# Altium project 2560_TrainingKit.PrjPcb (part 2 of 4)

## Sheet [04] - TK2560_Power.SchDoc: 2560_TrainingKit
size A4; SheetNumber: 5; SheetTotal: 15
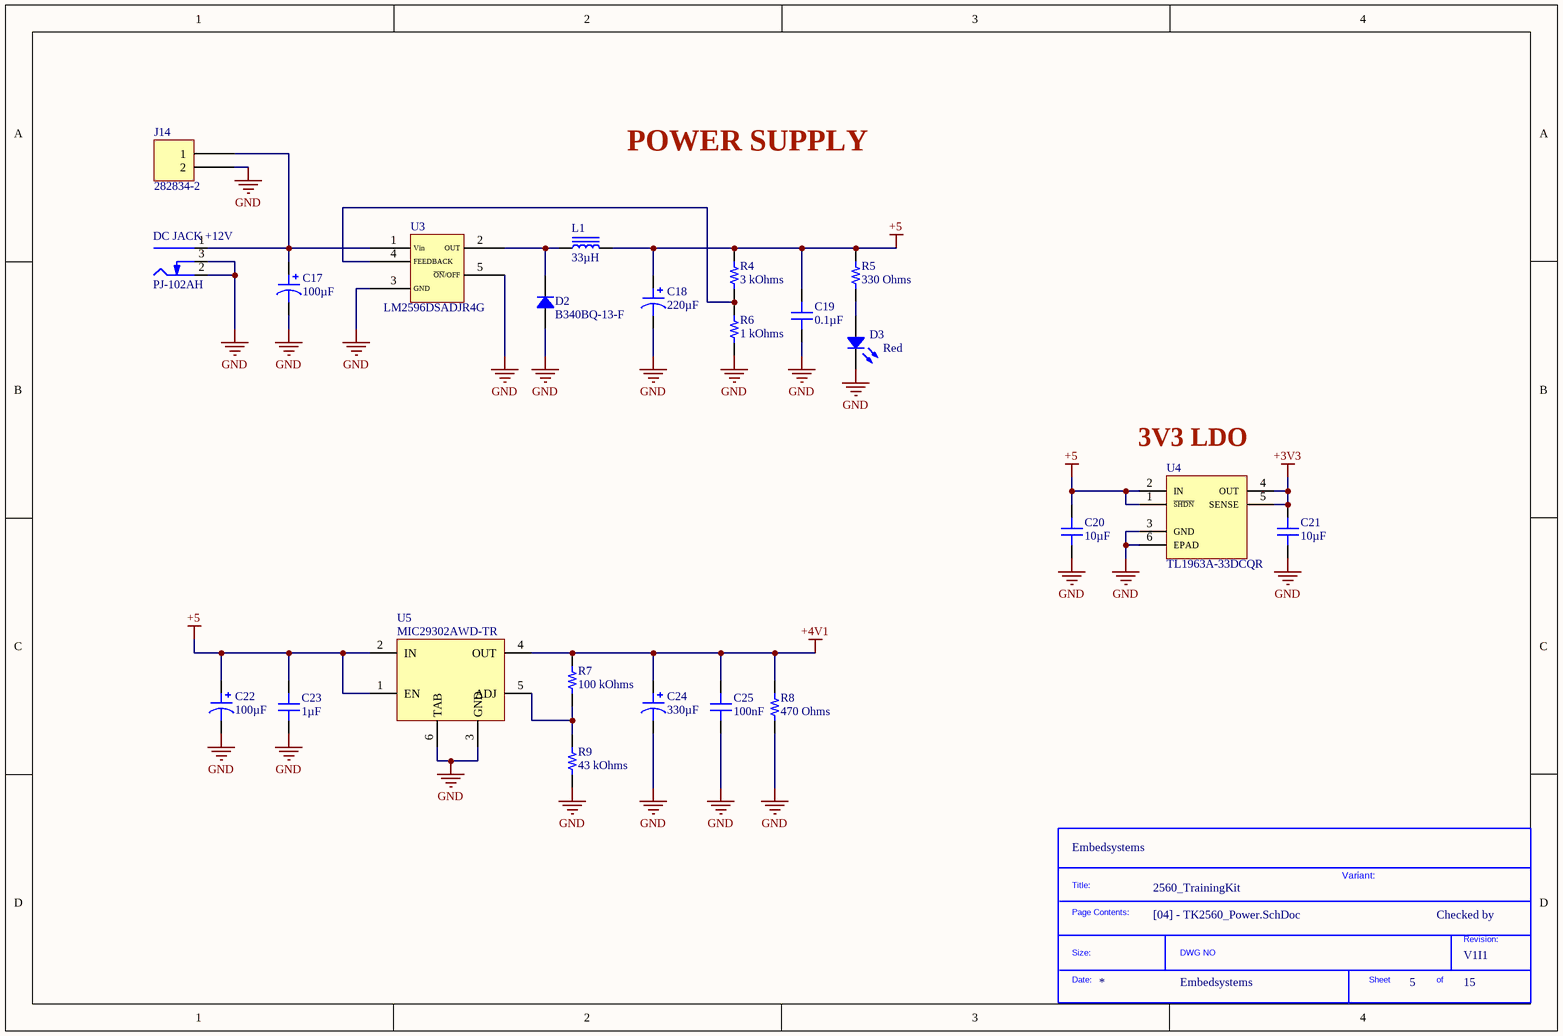
[diagram p3: [04] - TK2560_Power.SchDoc]

### Parts
(Parts that share a designator on the sheet are numbered #1, #2 ... from top to bottom, then left to right.)
*?#3  SDTitleBlock  (value not drawn)  (graphical)
C17  100µF  [CAP ALSMD 8.3MM H10.5MM]
C18  220µF  [CAP ALSMD 8.3MM H10.5MM]
C19  0.1µF  [CAP 0805_2012]
C20  10µF  [CAP 0805_2012]
C21  10µF  [CAP 0805_2012]
C22  100µF  [CAP POL 1411_3528]
C23  1µF  [CAP 0805_2012]
C24  330µF  [CAP POL 1411_3528]
C25  100nF  [CAP 0805_2012]
D2  B340BQ-13-F  [DO214AA SMB]
D3  Red  [LED 1206_3216 RED]
DC_JACK_+12V  PJ-102AH  [CUI PJ-102AH]
J14  282834-2  [TE 282834-2]
L1  33µH  [BOURNS SRR1280]
R4  3 kOhms  [RES 0805_2012]
R5  330 Ohms  [RES 0805_2012]
R6  1 kOhms  [RES 0805_2012]
R7  100 kOhms  [RES 0805_2012]
R8  470 Ohms  [RES 0805_2012]
R9  43 kOhms  [RES 0805_2012]
U3  LM2596DSADJR4G  [D2PAK 5_LEAD]
U4  TL1963A-33DCQR  [DCQ(R-PDSO-G6)]
U5  MIC29302AWD-TR  [TO-252-5]

### Nets
+3V3: C21.2 U4.4(OUT) U4.5(SENSE)
+4V1: C24.1 C25.2 R7.2 R8.2 U5.4(OUT)
+5: C18.1 C19.2 C20.2 C22.1 C23.2 L1.2 R4.2 R5.2 U4.1(~{SHDN}) U4.2(IN) U5.1(EN) U5.2(IN)
GND: C17.2 C18.2 C19.1 C20.1 C21.1 C22.2 C23.1 C24.2 C25.1 D2.1 D3.2 DC_JACK_+12V.2(Outer) DC_JACK_+12V.3(SW) J14.2 R6.1 R8.1 R9.1 U3.3(GND) U3.5(~{ON}/OFF) U4.3(GND) U4.6(EPAD) U5.3(GND) U5.6(TAB)
NetC17_1: C17.1 DC_JACK_+12V.1(Centre) J14.1 U3.1(Vin)
NetD2_2: D2.2 L1.1 U3.2(OUT)
NetD3_1: D3.1 R5.1
NetR4_1: R4.1 R6.2 U3.4(FEEDBACK)
NetR7_1: R7.1 R9.2 U5.5(ADJ)

### Notes on the sheet
- POWER SUPPLY
- (near U4) 3V3 LDO
- Variant:
- Checked by
- (in symbol SDTitleBlock) Title:; Page Contents:; Revision:; Size:; DWG NO; Date:; Sheet; of

### Library data of the parts
C17 = UWZ1H101MCL1GS: CAP ALUM 100UF 20% 50V SMD; Manufacturer: Nichicon; Lifetime @ Temp.: 1000 Hrs @ 105°C; Polarization: Polar; Ripple Current @ High Frequency: 210mA @ 10kHz; Ripple Current @ Low Frequency: 140mA @ 120Hz; Surface Mount Land Size: 0.327" L x 0.327" W (8.30mm x 8.30mm); Part Number: UWZ1H101MCL1GS; Applications: High Temperature Reflow; Capacitance: 100µF; ComponentLink1Description: Datasheet; ComponentLink1URL: http://nichicon-us.com/english/products/pdfs/e-uwz.pdf; ComponentLink2Description: DigiKey Link; ComponentLink2URL: http://digikey.com/product-detail/en/nichicon/UWZ1H101MCL1GS/493-6336-1-ND/3438850; Device Package: Radial, Can - SMD; Height - Seated (Max): 0.413" (10.50mm); LastUpdated: 02/09/2020 01:25:15; Lifecycle Status: Active; Minimum Order: 1; Mounting Type: Surface Mount; Operating Temperature: -55°C ~ 105°C; Package / Case: Radial, Can - SMD; Packaging: TapeAndReel; PartId: 7569; Part Status: Active; Price: 0.20; Series: UWZ; Size / Dimension: 0.315" Dia (8.00mm); Supplier 1: DigiKey; Supplier Part Number 1: 493-6336-1-ND; Tolerance: ±20%; Value: 100µF; Voltage - Rated: 50V
C18 = UUR1E221MNL6GS: CAP ALUM 220UF 20% 25V SMD; Manufacturer: Nichicon; Lifetime @ Temp.: 2000 Hrs @ 85°C; Ripple Current @ High Frequency: 301.6mA @ 10kHz; Ripple Current @ Low Frequency: 232mA @ 120Hz; Surface Mount Land Size: 0.327" L x 0.327" W (8.30mm x 8.30mm); Part Number: UUR1E221MNL6GS; Applications: General Purpose; Capacitance: 220µF; ComponentLink1Description: Datasheet; ComponentLink1URL: http://nichicon-us.com/english/products/pdfs/e-uur.pdf; ComponentLink2Description: DigiKey Link; ComponentLink2URL: http://digikey.com/product-detail/en/nichicon/UUR1E221MNL6GS/493-6222-1-ND/3438735; Device Package: Radial, Can - SMD; Height - Seated (Max): 0.413" (10.50mm); LastUpdated: 02/09/2020 01:25:16; Lifecycle Status: Active; Minimum Order: 1; Mounting Type: Surface Mount; Operating Temperature: -40°C ~ 85°C; Package / Case: Radial, Can - SMD; Packaging: TapeAndReel; PartId: 7456; Part Status: Active; Price: 0.19; Series: UUR; Size / Dimension: 0.315" Dia (8.00mm); Supplier 1: DigiKey; Supplier Part Number 1: 493-6222-1-ND; Tolerance: ±20%; Value: 220µF; Voltage - Rated: 25V
C19 = 160R15W104KV4T: CAP CER 0.1UF 16V X7R 0805; Manufacturer: Johanson Dielectrics Inc.; Tolerance: ±10%; Part Number: 160R15W104KV4T; Value: 0.1µF; Applications: General Purpose; Capacitance: 0.1µF; ComponentLink1Description: Datasheet; ComponentLink1URL: https://www.johansondielectrics.com/downloads/catalog/johanson-dielectrics-product-catalog.pdf; ComponentLink2Description: DigiKey Link; ComponentLink2URL: http://digikey.com/product-detail/en/johanson-dielectrics-inc/160R15W104KV4T/709-1183-1-ND/1859515; Device Package: 0805 (2012 Metric); LastUpdated: 02/09/2020 01:04:30; Lifecycle Status: Active; Minimum Order: 1; Mounting Type: Surface Mount, MLCC; Operating Temperature: -55°C ~ 125°C; Package / Case: 0805 (2012 Metric); Packaging: TapeAndReel; PartId: 9125; Part Status: Active; Price: 0.03; Series: -; Size / Dimension: 0.080" L x 0.050" W (2.03mm x 1.27mm); Supplier 1: DigiKey; Supplier Part Number 1: 709-1183-1-ND; Temperature Coefficient: X7R; Thickness (Max): 0.050" (1.27mm); Voltage - Rated: 16V
C20 C21 = 0805BW106K160NGT: CAP CER 10UF 16V X5R 0805; Manufacturer: Knowles Novacap; Tolerance: ±10%; Part Number: 0805BW106K160NGT; Value: 10µF; Applications: General Purpose; Capacitance: 10µF; ComponentLink1Description: Datasheet; ComponentLink1URL: https://www.knowlescapacitors.com/getattachment/6c8d48ef-fc2b-4752-ae2c-ce6c208de0c4/High-Capacitance-Chip.aspx; ComponentLink2Description: DigiKey Link; ComponentLink2URL: http://digikey.com/product-detail/en/knowles-novacap/0805BW106K160NGT/1763-1170-1-ND/7303990; Device Package: 0805 (2012 Metric); Features: Gold Flash Termination; LastUpdated: 02/09/2020 01:04:27; Lifecycle Status: Active; Minimum Order: 1; Mounting Type: Surface Mount, MLCC; Operating Temperature: -55°C ~ 85°C; Package / Case: 0805 (2012 Metric); Packaging: TapeAndReel; PartId: 10571; Part Status: Active; Price: 1.32; Series: -; Size / Dimension: 0.080" L x 0.050" W (2.03mm x 1.27mm); Supplier 1: DigiKey; Supplier Part Number 1: 1763-1170-1-ND; Temperature Coefficient: X5R; Thickness (Max): 0.054" (1.37mm); Voltage - Rated: 16V
C22 = T494B107M006AT: CAP TANT 100UF 20% 6.3V 1411; Manufacturer: KEMET; Manufacturer Size Code: B; ESR (Equivalent Series Resistance): 1.5Ohm; Lifetime @ Temp.: 2000 Hrs @ 125°C; Type: Molded; Part Number: T494B107M006AT; Value: 100µF; Capacitance: 100µF; ComponentLink1Description: Datasheet; ComponentLink1URL: https://api.kemet.com/component-edge/download/datasheet/T494B107M006AT.pdf; ComponentLink2Description: DigiKey Link; ComponentLink2URL: http://digikey.com/product-detail/en/kemet/T494B107M006AT/399-3833-1-ND/819158; Device Package: 1411 (3528 Metric); Features: General Purpose; Height - Seated (Max): 0.083" (2.10mm); LastUpdated: 02/09/2020 01:15:46; Lifecycle Status: Active; Minimum Order: 1; Mounting Type: Surface Mount; Operating Temperature: -55°C ~ 125°C; Package / Case: 1411 (3528 Metric); Packaging: TapeAndReel; PartId: 7; Part Status: Active; Price: 0.48; Series: T494; Size / Dimension: 0.138" L x 0.110" W (3.50mm x 2.80mm); Supplier 1: DigiKey; Supplier Part Number 1: 399-3833-1-ND; Tolerance: ±20%; Voltage - Rated: 6.3V
C23 = 0805YD105KAT4A: CAP CER 1UF 16V X5R 0805; Manufacturer: AVX Corporation; Tolerance: ±10%; Part Number: 0805YD105KAT4A; Value: 1µF; Applications: General Purpose; Capacitance: 1µF; ComponentLink1Description: Datasheet; ComponentLink1URL: http://datasheets.avx.com/cx5r.pdf; ComponentLink2Description: DigiKey Link; ComponentLink2URL: http://digikey.com/product-detail/en/avx-corporation/0805YD105KAT4A/478-11535-1-ND/8108827; Device Package: 0805 (2012 Metric); LastUpdated: 02/09/2020 01:04:15; Lifecycle Status: Active; Minimum Order: 1; Mounting Type: Surface Mount, MLCC; Operating Temperature: -55°C ~ 85°C; Package / Case: 0805 (2012 Metric); Packaging: TapeAndReel; PartId: 15586; Part Status: Active; Price: 0.05; Series: -; Size / Dimension: 0.079" L x 0.049" W (2.01mm x 1.25mm); Supplier 1: DigiKey; Supplier Part Number 1: 478-11535-1-ND; Temperature Coefficient: X5R; Thickness (Max): 0.055" (1.40mm); Voltage - Rated: 16V
C24 = F950G337KTAAQ2: CAP TANT 330UF 10% 4V 1411; Manufacturer: AVX Corporation; Manufacturer Size Code: T; ESR (Equivalent Series Resistance): 800mOhm; Type: Conformal Coated; Part Number: F950G337KTAAQ2; Value: 330µF; Capacitance: 330µF; ComponentLink1Description: Datasheet; ComponentLink1URL: http://datasheets.avx.com/F95.pdf; ComponentLink2Description: DigiKey Link; ComponentLink2URL: http://digikey.com/product-detail/en/avx-corporation/F950G337KTAAQ2/478-8377-1-ND/4005744; Device Package: 1411 (3528 Metric); Features: General Purpose; Height - Seated (Max): 0.063" (1.60mm); LastUpdated: 02/09/2020 01:15:46; Lifecycle Status: Active; Minimum Order: 1; Mounting Type: Surface Mount; Operating Temperature: -55°C ~ 125°C; Package / Case: 1411 (3528 Metric); Packaging: TapeAndReel; PartId: 9; Part Status: Active; Price: 0.48; Series: F95, Frameless™; Size / Dimension: 0.138" L x 0.106" W (3.50mm x 2.70mm); Supplier 1: DigiKey; Supplier Part Number 1: 478-8377-1-ND; Tolerance: ±10%; Voltage - Rated: 4V
C25 = AC0805KKX8R9BB104: CAP CER 0805 10% X8R 50V 100NF; Manufacturer: Yageo; Capacitance: 0.1µF; Part Number: AC0805KKX8R9BB104; Value: 100nF; Applications: Automotive; ComponentLink1Description: Datasheet; ComponentLink1URL: http://www.yageo.com/documents/recent/AC0805KKX8R9BB104.pdf; ComponentLink2Description: DigiKey Link; ComponentLink2URL: http://digikey.com/product-detail/en/yageo/AC0805KKX8R9BB104/311-4624-1-ND/9699550; Device Package: 0805 (2012 Metric); LastUpdated: 02/09/2020 01:04:20; Lifecycle Status: Active; Minimum Order: 1; Mounting Type: Surface Mount, MLCC; Operating Temperature: -55°C ~ 150°C; Package / Case: 0805 (2012 Metric); Packaging: TapeAndReel; PartId: 14076; Part Status: Active; Price: 0.06; Ratings: AEC-Q200; Series: AC; Size / Dimension: 0.079" L x 0.049" W (2.00mm x 1.25mm); Supplier 1: DigiKey; Supplier Part Number 1: 311-4624-1-ND; Temperature Coefficient: X8R; Thickness (Max): 0.057" (1.45mm); Tolerance: ±10%; Voltage - Rated: 50V
D2 = B340BQ-13-F: DIODE SCHOTTKY 40V 3A SMB; Manufacturer: Diodes Incorporated; Capacitance @ Vr, F: 200pF @ 4V, 1MHz; Current - Reverse Leakage @ Vr: 500µA @ 40V; Speed: Fast Recovery =< 500ns, > 200mA (Io); Voltage - Forward (Vf) (Max) @ If: 500mV @ 3A; Part Number: B340BQ-13-F; ComponentLink1Description: Datasheet; ComponentLink1URL: https://www.diodes.com/assets/Datasheets/B340BQ-B360BQ.pdf; ComponentLink2Description: DigiKey Link; ComponentLink2URL: http://digikey.com/product-detail/en/diodes-incorporated/B340BQ-13-F/B340BQ-13-FDICT-ND/6012577; Current - Average Rectified (Io): 3A; Diode Type: Schottky; LastUpdated: 02/09/2020 01:18:53; Lifecycle Status: Active; Minimum Order: 1; Mounting Type: Surface Mount; Operating Temperature - Junction: -55°C ~ 150°C; Package / Case: DO-214AA, SMB; Packaging: TapeAndReel; PartId: 1474; Part Status: Active; Price: 0.12; Series: Automotive, AEC-Q101; Supplier 1: DigiKey; Supplier Part Number 1: B340BQ-13-FDICT-ND; Supplier Device Package: SMB; Voltage - DC Reverse (Vr) (Max): 40V
D3 = APTL3216SURCK-01: LED SMD; Manufacturer: Kingbright; Configuration: 1206; Current - Test: 20mA; Lens Color: Colorless; Lens Size: 1.10mm Dia; Lens Style: Round with Domed Top; Lens Transparency: Clear; Millicandela Rating: 230mcd; Viewing Angle: 80°; Voltage - Forward (Vf) (Typ): 1.95V; Wavelength - Dominant: 630nm; Wavelength - Peak: 645nm; Part Number: APTL3216SURCK-01; Color: Red; ComponentLink1Description: Datasheet; ComponentLink1URL: http://www.kingbrightusa.com/images/catalog/SPEC/APTL3216SURCK-01.pdf; ComponentLink2Description: DigiKey Link; ComponentLink2URL: http://digikey.com/product-detail/en/kingbright/APTL3216SURCK-01/754-APTL3216SURCK-01CT-ND/10293135; Device Package: 1206 (3216 Metric); Height (Max): 1.20mm; LastUpdated: 9/2/2020 01:21:09; Lifecycle Status: Active; Minimum Order: 1; Mounting Type: Surface Mount; Package / Case: 1206 (3216 Metric); Packaging: TapeAndReel; PartId: 229; Part Status: Active; Price: 0.08; Series: Heli-R; Size / Dimension: 3.20mm L x 1.60mm W; Supplier 1: DigiKey; Supplier Part Number 1: 754-APTL3216SURCK-01CT-ND; Supplier Device Package: 1206; Value: Red
DC_JACK_+12V = PJ-102AH: CONN PWR JACK 2X5.5MM SOLDER; Manufacturer: CUI Devices; Actual Diameter: 0.079" (2.00mm ID), 0.256" (6.50mm OD); Current Rating (Amps): 5A; Gender: Male; Industry Recognized Mating Diameter: 2.00mm ID (0.079"), 5.50mm OD (0.217"); Internal Switch(s): Single Switch, Normally Closed; Material Flammability Rating: UL94 V-0; Mating Length/Depth: 0.354" (9.00mm); Number of Positions/Contacts: 2 Conductors, 3 Contacts; Shielding: Unshielded; Voltage - Rated: 24VDC; Part Number: PJ-102AH; ComponentLink1Description: Datasheet; ComponentLink1URL: https://www.cuidevices.com/product/resource/digikeypdf/pj-102ah.pdf; ComponentLink2Description: DigiKey Link; ComponentLink2URL: //digikey.com/product-detail/en/cui-devices/PJ-102AH/CP-102AH-ND/408448; Connector Type: Jack; LastUpdated: 16/12/2019 19:01:27; Lifecycle Status: 0; Minimum Order: 1; Mounting Type: Through Hole, Right Angle; Packaging: Tray; Part Status: Active; Price: 0.76; Series: -; Supplier 1: DigiKey; Supplier Part Number 1: CP-102AH-ND; Termination: Solder
J14 = 282834-2: TERM BLK 2P SIDE ENT 2.54MM PCB; Manufacturer: TE Connectivity AMP Connectors; Current: 10A; Mating Orientation: Horizontal with Board; Number of Levels: 1; Pitch: 0.100" (2.54mm); Positions Per Level: 2; Voltage: 150V; Wire Gauge: 16-30 AWG; Wire Termination: Screw - Rising Cage Clamp; Part Number: 282834-2; Color: Green; ComponentLink1Description: Datasheet; ComponentLink1URL: https://www.te.com/commerce/DocumentDelivery/DDEController?Action=srchrtrv&DocNm=282834&DocType=Customer+Drawing&DocLang=English; ComponentLink2Description: DigiKey Link; ComponentLink2URL: http://digikey.com/product-detail/en/te-connectivity-amp-connectors/282834-2/A98333-ND/1150135; LastUpdated: 15/01/2020 04:15:38; Lifecycle Status: Active; Minimum Order: 1; Mounting Type: Through Hole; Packaging: Bulk; Part Status: Active; Price: 0.88; Series: Buchanan; Supplier 1: DigiKey; Supplier Part Number 1: A98333-ND
L1 = SRR1280-330M: FIXED IND 33UH 3.5A 57 MOHM SMD; Manufacturer: Bourns Inc.; Current - Saturation: 3.3A; DC Resistance (DCR): 57mOhm Max; Frequency - Self Resonant: 9.5MHz; Inductance Frequency - Test: 100kHz; Material - Core: Ferrite; Q @ Freq: 28 @ 2.52MHz; Shielding: Shielded; Tolerance: ±20%; Type: Wirewound; Part Number: SRR1280-330M; ComponentLink1Description: Datasheet; ComponentLink1URL: https://www.bourns.com/docs/Product-Datasheets/SRR1280.pdf; ComponentLink2Description: DigiKey Link; ComponentLink2URL: http://digikey.com/product-detail/en/bourns-inc/SRR1280-330M/SRR1280-330MCT-ND/2127440; Current Rating (Amps): 3.5A; Device Package: Nonstandard; Height - Seated (Max): 0.315" (8.00mm); Inductance: 33µH; LastUpdated: 02/09/2020 01:22:09; Lifecycle Status: Active; Minimum Order: 1; Mounting Type: Surface Mount; Operating Temperature: -40°C ~ 125°C; Package / Case: Nonstandard; Packaging: TapeAndReel; PartId: 25; Part Status: Active; Price: 0.65; Series: SRR1280; Size / Dimension: 0.492" L x 0.492" W (12.50mm x 12.50mm); Supplier 1: DigiKey; Supplier Part Number 1: SRR1280-330MCT-ND; Value: 33µH
R4 = ERJ-PB6D3001V: RES SMD 3K OHM 0.5% 1/4W 0805; Manufacturer: Panasonic Electronic Components; Power (Watts): 0.25W, 1/4W; Temperature Coefficient: ±50ppm/°C; Part Number: ERJ-PB6D3001V; Value: 3 kOhms; ComponentLink1Description: Datasheet; ComponentLink1URL: https://industrial.panasonic.com/cdbs/www-data/pdf/RDM0000/AOA0000C328.pdf; ComponentLink2Description: DigiKey Link; ComponentLink2URL: http://digikey.com/product-detail/en/panasonic-electronic-components/ERJ-PB6D3001V/P21071CT-ND/6215326; Composition: Thick Film; Device Package: 0805 (2012 Metric); Features: Automotive AEC-Q200, Pulse Withstanding; Height - Seated (Max): 0.028" (0.70mm); LastUpdated: 02/09/2020 01:14:32; Lifecycle Status: Active; Minimum Order: 1; Number of Terminations: 2; Operating Temperature: -55°C ~ 155°C; Package / Case: 0805 (2012 Metric); Packaging: TapeAndReel; PartId: 48478; Part Status: Active; Price: 0.03; Ratings: AEC-Q200; Resistance: 3 kOhms; Series: ERJ; Size / Dimension: 0.079" L x 0.049" W (2.00mm x 1.25mm); Supplier 1: DigiKey; Supplier Part Number 1: P21071CT-ND; Supplier Device Package: 0805; Tolerance: ±0.5%
R5 = ERJ-6GEYJ331V: RES SMD 330 OHM 5% 1/8W 0805; Manufacturer: Panasonic Electronic Components; Power (Watts): 0.125W, 1/8W; Temperature Coefficient: ±200ppm/°C; Part Number: ERJ-6GEYJ331V; Value: 330 Ohms; ComponentLink1Description: Datasheet; ComponentLink1URL: http://industrial.panasonic.com/www-cgi/jvcr13pz.cgi?E+PZ+3+AOA0001+ERJ6GEYJ331V+7+WW; ComponentLink2Description: DigiKey Link; ComponentLink2URL: http://digikey.com/product-detail/en/panasonic-electronic-components/ERJ-6GEYJ331V/P330ACT-ND/90025; Composition: Thick Film; Device Package: 0805 (2012 Metric); Features: Automotive AEC-Q200; Height - Seated (Max): 0.028" (0.70mm); LastUpdated: 02/09/2020 01:15:19; Lifecycle Status: Active; Minimum Order: 1; Number of Terminations: 2; Operating Temperature: -55°C ~ 155°C; Package / Case: 0805 (2012 Metric); Packaging: TapeAndReel; PartId: 30017; Part Status: Active; Price: 0.01; Ratings: AEC-Q200; Resistance: 330 Ohms; Series: ERJ; Size / Dimension: 0.079" L x 0.049" W (2.00mm x 1.25mm); Supplier 1: DigiKey; Supplier Part Number 1: P330ACT-ND; Supplier Device Package: 0805; Tolerance: ±5%
R6 = RNCP0805FTD1K00: RES 1K OHM 1% 1/4W 0805; Manufacturer: Stackpole Electronics Inc; Power (Watts): 0.25W, 1/4W; Temperature Coefficient: ±100ppm/°C; Part Number: RNCP0805FTD1K00; Value: 1 kOhms; ComponentLink1Description: Datasheet; ComponentLink1URL: https://www.seielect.com/catalog/sei-rncp.pdf; ComponentLink2Description: DigiKey Link; ComponentLink2URL: http://digikey.com/product-detail/en/stackpole-electronics-inc/RNCP0805FTD1K00/RNCP0805FTD1K00CT-ND/2240568; Composition: Thin Film; Device Package: 0805 (2012 Metric); Features: Anti-Sulfur, Moisture Resistant; Height - Seated (Max): 0.024" (0.60mm); LastUpdated: 02/09/2020 01:15:23; Lifecycle Status: Active; Minimum Order: 1; Number of Terminations: 2; Operating Temperature: -55°C ~ 155°C; Package / Case: 0805 (2012 Metric); Packaging: TapeAndReel; PartId: 28023; Part Status: Active; Price: 0.01; Resistance: 1 kOhms; Series: RNCP; Size / Dimension: 0.079" L x 0.049" W (2.00mm x 1.25mm); Supplier 1: DigiKey; Supplier Part Number 1: RNCP0805FTD1K00CT-ND; Supplier Device Package: 0805; Tolerance: ±1%
R7 = RCS0805100KFKEA: RES SMD 100K OHM 1% 0.4W 0805; Manufacturer: Vishay Dale; Power (Watts): 0.4W, 2/5W; Temperature Coefficient: ±100ppm/°C; Part Number: RCS0805100KFKEA; Value: 100 kOhms; ComponentLink1Description: Datasheet; ComponentLink1URL: http://www.vishay.com/docs/20065/rcse3.pdf; ComponentLink2Description: DigiKey Link; ComponentLink2URL: http://digikey.com/product-detail/en/vishay-dale/RCS0805100KFKEA/541-2850-1-ND/5867143; Composition: Thick Film; Device Package: 0805 (2012 Metric); Features: Automotive AEC-Q200, Pulse Withstanding; Height - Seated (Max): 0.020" (0.50mm); LastUpdated: 02/09/2020 01:15:24; Lifecycle Status: Active; Minimum Order: 1; Number of Terminations: 2; Operating Temperature: -55°C ~ 155°C; Package / Case: 0805 (2012 Metric); Packaging: TapeAndReel; PartId: 27789; Part Status: Active; Price: 0.03; Ratings: AEC-Q200; Resistance: 100 kOhms; Series: RCS e3; Size / Dimension: 0.079" L x 0.049" W (2.00mm x 1.25mm); Supplier 1: DigiKey; Supplier Part Number 1: 541-2850-1-ND; Supplier Device Package: 0805; Tolerance: ±1%
R8 = CRCW0805470RFKEAHP: RES SMD 470 OHM 1% 1/2W 0805; Manufacturer: Vishay Dale; Power (Watts): 0.5W, 1/2W; Temperature Coefficient: ±100ppm/°C; Part Number: CRCW0805470RFKEAHP; Value: 470 Ohms; ComponentLink1Description: Datasheet; ComponentLink1URL: http://www.vishay.com/docs/20043/crcwhpe3.pdf; ComponentLink2Description: DigiKey Link; ComponentLink2URL: http://digikey.com/product-detail/en/vishay-dale/CRCW0805470RFKEAHP/541-470TCT-ND/2222848; Composition: Thick Film; Device Package: 0805 (2012 Metric); Features: Automotive AEC-Q200, Pulse Withstanding; Height - Seated (Max): 0.020" (0.50mm); LastUpdated: 02/09/2020 01:15:18; Lifecycle Status: Active; Minimum Order: 1; Number of Terminations: 2; Operating Temperature: -55°C ~ 155°C; Package / Case: 0805 (2012 Metric); Packaging: TapeAndReel; PartId: 30309; Part Status: Active; Price: 0.03; Ratings: AEC-Q200; Resistance: 470 Ohms; Series: CRCW-HP; Size / Dimension: 0.079" L x 0.049" W (2.00mm x 1.25mm); Supplier 1: DigiKey; Supplier Part Number 1: 541-470TCT-ND; Supplier Device Package: 0805; Tolerance: ±1%
R9 = RT0805BRD0743KL: RES SMD 43K OHM 0.1% 1/8W 0805; Manufacturer: Yageo; Power (Watts): 0.125W, 1/8W; Temperature Coefficient: ±25ppm/°C; Part Number: RT0805BRD0743KL; Value: 43 kOhms; ComponentLink1Description: Datasheet; ComponentLink1URL: https://www.yageo.com/upload/media/product/productsearch/datasheet/rchip/PYu-RT_1-to-0.01_RoHS_L_11.pdf; ComponentLink2Description: DigiKey Link; ComponentLink2URL: http://digikey.com/product-detail/en/yageo/RT0805BRD0743KL/YAG1899CT-ND/5139347; Composition: Thin Film; Device Package: 0805 (2012 Metric); Height - Seated (Max): 0.024" (0.60mm); LastUpdated: 02/09/2020 01:15:12; Lifecycle Status: Active; Minimum Order: 1; Number of Terminations: 2; Operating Temperature: -55°C ~ 155°C; Package / Case: 0805 (2012 Metric); Packaging: TapeAndReel; PartId: 33531; Part Status: Active; Price: 0.05; Resistance: 43 kOhms; Series: RT; Size / Dimension: 0.079" L x 0.049" W (2.00mm x 1.25mm); Supplier 1: DigiKey; Supplier Part Number 1: YAG1899CT-ND; Supplier Device Package: 0805; Tolerance: ±0.1%
U3 = LM2596DSADJR4G: Sw. Regulator 3A Adj. Step-Down D2PAK-5; Manufacturer: ON Semiconductor; Number of Outputs: 1; Max Input Voltage: 40V; Min Input Voltage: 4.5V; Output Voltage: 37V; Efficiency: 73%; Switching Frequency: 150kHz; Synchronous Rectifier: No; Min Output Voltage: 1.23V; Topology: Buck-Boost; Output Type: Adjustable; Supplier 1: Digi-Key; Manufacturer Part Number: LM2596DSADJR4G; RoHS: Yes; Category: Voltage Regulators - Switching; Stock 1: 3215; Pricing 1: 1=2.24000, 10=2.01100, 25=1.89760, 100=1.59390 (USD); Mount: Surface Mount; Case/Package: D2PAK; Number of Pins: 5; Min Operating Temperature: -40°C; Max Operating Temperature: 125°C; Max Output Current: 3A; Packaging: Tape and Reel; Output Current: 3A; Package Quantity: 800; Max Output Voltage: 37V; Operating Supply Voltage: 40V; Series: LM2596; Switching Frequency-Max: 150kHz; Length: 10.24mm; Width: 4.572mm; Height: 9.347mm; Radiation Hardening: No; REACH SVHC: No SVHC; Lead Free: Lead Free; Halogen Free: Halogen Free; RoHS Compliant: Yes; ComponentLink1URL: https://datasheet.ciiva.com/15113/getdatasheetpartid-224280-15113862.pdf?src-supplier=Verical; ComponentLink1Description: https://datasheet.ciiva.com/15113/getdatasheetpartid-224280-15113862.pdf?src-supplier=Verical; ComponentLink2URL: https://datasheet.ciiva.com/6603/lm2596-d-6603896.pdf?src-supplier=Digi-Key; ComponentLink2Description: https://datasheet.ciiva.com/6603/lm2596-d-6603896.pdf?src-supplier=Digi-Key; ComponentLink3URL: https://datasheet.ciiva.com/6603/lm2596-d-6603897.pdf?src-supplier=Digi-Key; ComponentLink3Description: https://datasheet.ciiva.com/6603/lm2596-d-6603897.pdf?src-supplier=Digi-Key; ComponentLink4URL: https://datasheet.ciiva.com/6603/lm2596-d-6603898.pdf?src-supplier=Digi-Key; ComponentLink4Description: https://datasheet.ciiva.com/6603/lm2596-d-6603898.pdf?src-supplier=Digi-Key; ComponentLink5URL: https://datasheet.ciiva.com/8270/lm2596-d-8270188.pdf?src-supplier=Avnet; ComponentLink5Description: https://datasheet.ciiva.com/8270/lm2596-d-8270188.pdf?src-supplier=Avnet; Supplier Part Number 1: LM2596DSADJR4GOSCT-ND
U4 = TL1963A-33DCQR: IC REG LINEAR 3.3V 1.5A SOT223-6; Manufacturer: Texas Instruments; Dropout Voltage: 340mV; Number of Outputs: 1; Max Input Voltage: 20V; Min Input Voltage: 2.1V; Min Current Limit: 1.6A; Input Bias Current: 1mA; Polarity: Positive; Accuracy: 3%; Output Type: Fixed; Supplier 1: Arrow Electronics; Manufacturer Part Number: TL1963A-33DCQR; RoHS: Yes; Category: Voltage Regulators - Linear; Stock 1: 1994; Pricing 1: 1=3.03940, 10=2.70250, 25=2.66220, 100=2.15850, 250=2.13670, 500=1.82850, 1000=1.81010, 2500=2.81000, 25000=2.65000, 250000=1.72200, 1250000=1.24700, 2500000=1.24300 (USD); Case/Package: SOT-223; Number of Pins: 6; Contact Plating: Gold; Min Operating Temperature: -40°C; Max Operating Temperature: 125°C; Package Quantity: 1; Packaging: Tape and Reel; Output Voltage: 3.3V; Output Current: 1.5A; Max Output Current: 1.5A; Number of Regulators: 1; Quiescent Current: 1mA; Max Output Voltage: 3.3V; Min Output Voltage: 3.3V; Series: -; Radiation Hardening: No; Lead Free: Lead Free; RoHS Compliant: Yes; ComponentLink1URL: https://datasheet.ciiva.com/2046/tl1963a-2046161.pdf?src-supplier=Digi-Key; ComponentLink1Description: https://datasheet.ciiva.com/2046/tl1963a-2046161.pdf?src-supplier=Digi-Key; ComponentLink2URL: https://datasheet.ciiva.com/2046/tl1963a-2046162.pdf?src-supplier=Digi-Key; ComponentLink2Description: https://datasheet.ciiva.com/2046/tl1963a-2046162.pdf?src-supplier=Digi-Key; ComponentLink3URL: https://datasheet.ciiva.com/2046/tl1963a-2046163.pdf?src-supplier=Digi-Key; ComponentLink3Description: https://datasheet.ciiva.com/2046/tl1963a-2046163.pdf?src-supplier=Digi-Key; ComponentLink4URL: https://datasheet.ciiva.com/26176/tl1963a-25-26176569.pdf?src-supplier=Avnet+Europe; ComponentLink4Description: https://datasheet.ciiva.com/26176/tl1963a-25-26176569.pdf?src-supplier=Avnet+Europe; Supplier Part Number 1: TL1963A-33DCQR
U5 = MIC29302AWD-TR: IC REG LINEAR POS ADJ 3A TO252-5; Manufacturer: Microchip; Number of Outputs: 1; Min Input Voltage: 3V; Output Voltage: 15V; Dropout Voltage: 450mV; Polarity: Positive; Output Voltage Accuracy: 2%; Supplier 1: Digi-Key; Manufacturer Part Number: MIC29302AWD-TR; RoHS: No; Category: Voltage Regulators - Linear; Stock 1: 2431; Pricing 1: 1=1.96000, 25=1.64000, 100=1.49000 (USD); Mount: Surface Mount; Case/Package: TO-263-6; Min Operating Temperature: -40°C; Max Operating Temperature: 125°C; Packaging: Tape and Reel; Output Current: 3A; Number of Regulators: 1; Min Current Limit: 3A; Series: -; Lead Free: Lead Free; RoHS Compliant: No; ComponentLink1URL: https://datasheet.ciiva.com/6582/mic29302a-6582272.pdf?src-supplier=Digi-Key; ComponentLink1Description: https://datasheet.ciiva.com/6582/mic29302a-6582272.pdf?src-supplier=Digi-Key; ComponentLink2URL: https://datasheet.ciiva.com/6582/mic29302a-6582270.pdf?src-supplier=Digi-Key; ComponentLink2Description: https://datasheet.ciiva.com/6582/mic29302a-6582270.pdf?src-supplier=Digi-Key; Supplier Part Number 1: 576-4106-1-ND

## Sheet [06] - TK2560_InputKeys.SchDoc: 2560_TrainingKit
size A4; SheetNumber: 7; SheetTotal: 15
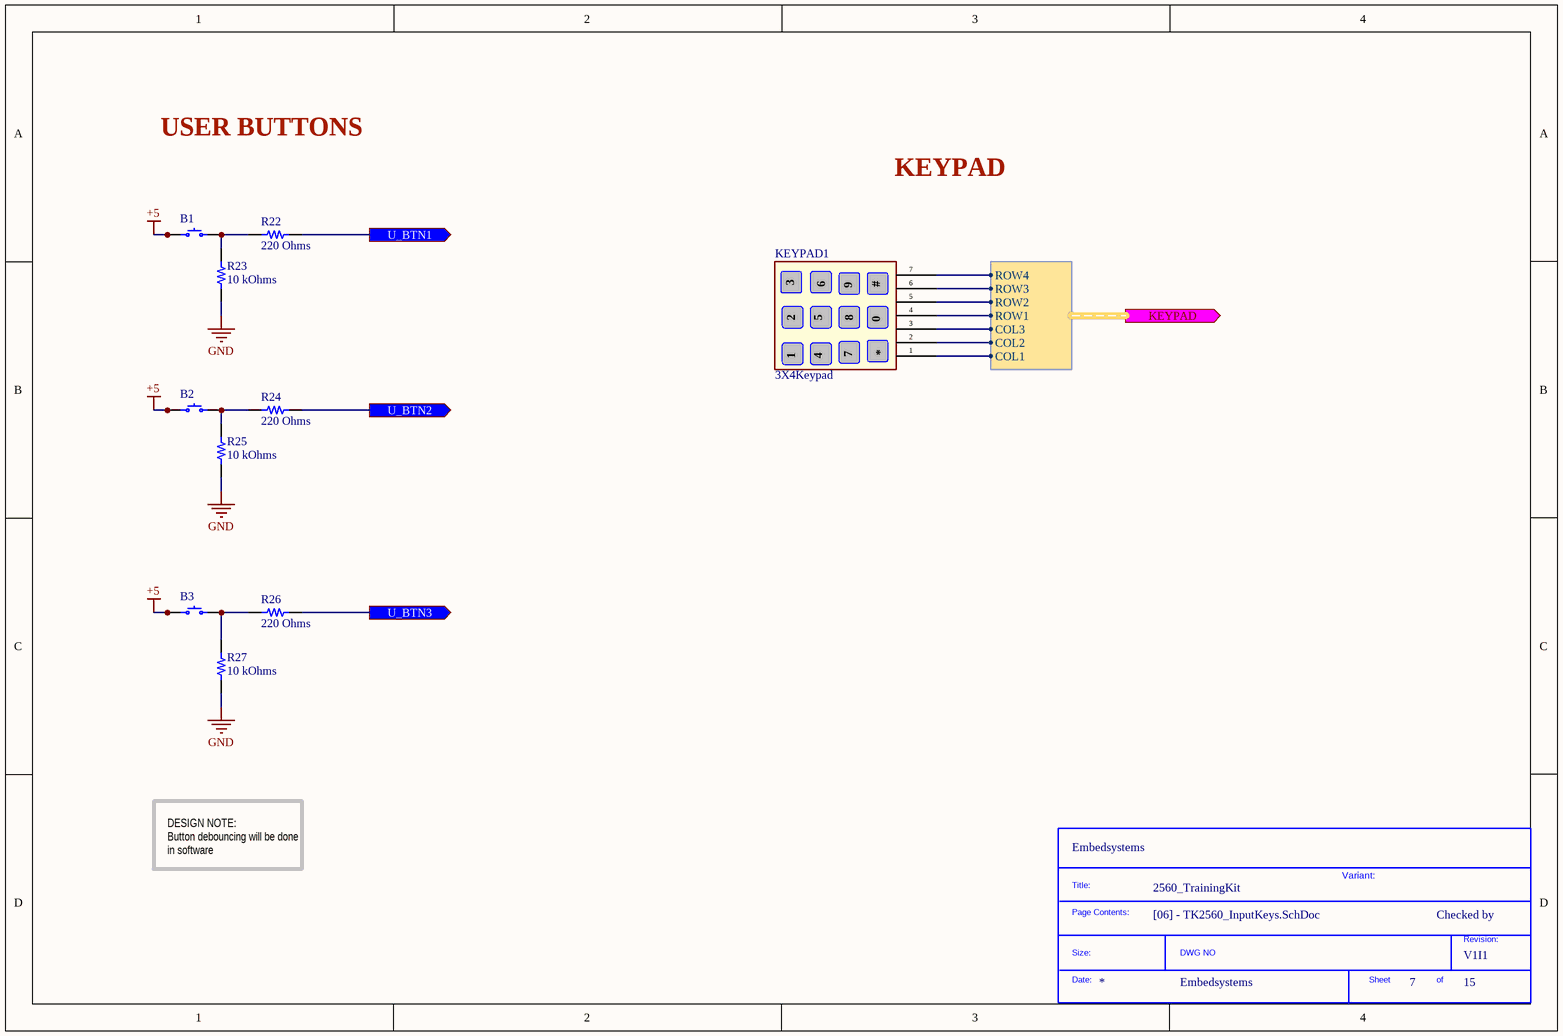
[diagram p4: [06] - TK2560_InputKeys.SchDoc]

### Parts
(Parts that share a designator on the sheet are numbered #1, #2 ... from top to bottom, then left to right.)
*?#4  SDTitleBlock  (value not drawn)  (graphical)
B1  PTS645SM43SMTR92 LFS  [C&K PTS645]  (value not drawn)
B2  PTS645SM43SMTR92 LFS  [C&K PTS645]  (value not drawn)
B3  PTS645SM43SMTR92 LFS  [C&K PTS645]  (value not drawn)
KEYPAD1  3X4Keypad  [COM-08653]
R22  220 Ohms  [RES 0805_2012]
R23  10 kOhms  [RES 0805_2012]
R24  220 Ohms  [RES 0805_2012]
R25  10 kOhms  [RES 0805_2012]
R26  220 Ohms  [RES 0805_2012]
R27  10 kOhms  [RES 0805_2012]

### Ports
KEYPAD (out, harness KEYPAD), U_BTN1 (out), U_BTN2 (out), U_BTN3 (out)

### Harnesses
KEYPAD: ROW1, ROW2, ROW3, ROW4, COL1, COL2, COL3

### Nets
+5: B1.1 B1.2 B2.1 B2.2 B3.1 B3.2
GND: R23.2 R25.2 R27.2
U_BTN1: R22.2 ; port U_BTN1
U_BTN2: R24.2 ; port U_BTN2
U_BTN3: R26.2 ; port U_BTN3
NetB1_3: B1.3 B1.4 R22.1 R23.1
NetB2_3: B2.3 B2.4 R24.1 R25.1
NetB3_3: B3.3 B3.4 R26.1 R27.1
NetKEYPAD1_1: KEYPAD1.1 ; port KEYPAD.COL1
NetKEYPAD1_2: KEYPAD1.2 ; port KEYPAD.COL2
NetKEYPAD1_3: KEYPAD1.3 ; port KEYPAD.COL3
NetKEYPAD1_4: KEYPAD1.4 ; port KEYPAD.ROW1
NetKEYPAD1_5: KEYPAD1.5 ; port KEYPAD.ROW2
NetKEYPAD1_6: KEYPAD1.6 ; port KEYPAD.ROW3
NetKEYPAD1_7: KEYPAD1.7 ; port KEYPAD.ROW4

### Notes on the sheet
- USER BUTTONS
- KEYPAD
- DESIGN NOTE:
  Button debouncing will be done in software
- Variant:
- Checked by
- (in symbol 3X4Keypad) 9; #; 8; 0
- (in symbol SDTitleBlock) Title:; Page Contents:; Revision:; Size:; DWG NO; Date:; Sheet; of

### Library data of the parts
B1-B3 = PTS645SM43SMTR92 LFS: SWITCH TACTILE SPST-NO 0.05A 12V; Manufacturer: C&K; Actuator Height off PCB, Vertical: 4.30mm; Actuator Orientation: Top Actuated; Actuator Type: Standard; Contact Rating @ Voltage: 0.05A @ 12VDC; Illumination: Non-Illuminated; Operating Force: 160gf; Outline: 6.00mm x 6.00mm; Switch Function: Off-Mom; Part Number: PTS645SM43SMTR92 LFS; Circuit: SPST-NO; ComponentLink1Description: Datasheet; ComponentLink1URL: https://dznh3ojzb2azq.cloudfront.net/products/Tactile/PTS645/documents/datasheet.pdf; ComponentLink2Description: DigiKey Link; ComponentLink2URL: http://digikey.com/product-detail/en/c-k/PTS645SM43SMTR92-LFS/CKN9112CT-ND/1146934; Features: Blue Actuator; LastUpdated: 09/04/2020 09:59:00; Lifecycle Status: Active; Minimum Order: 1; Mounting Type: Surface Mount; Operating Temperature: -20°C ~ 60°C; Packaging: TapeAndReel; Part Status: Active; Price: 0.09; Series: PTS645; Supplier 1: DigiKey; Supplier Part Number 1: CKN9112CT-ND; Termination Style: Gull Wing
KEYPAD1 = 3X4Keypad: 3x4 Matrix Keypad; Manufacturer: Adafruit Industries; Manufacturer Part Number: 3845; Stock 1: 43; Pricing 1: 1=6.50000 (USD); Supplier 1: Digi-Key; Supplier Part Number 1: 1528-2673-ND
R22 R24 R26 = ERJ-6ENF2200V: RES SMD 220 OHM 1% 1/8W 0805; Manufacturer: Panasonic Electronic Components; Power (Watts): 0.125W, 1/8W; Temperature Coefficient: ±100ppm/°C; Part Number: ERJ-6ENF2200V; Value: 220 Ohms; ComponentLink1Description: Datasheet; ComponentLink1URL: https://industrial.panasonic.com/cdbs/www-data/pdf/RDA0000/AOA0000C304.pdf; ComponentLink2Description: DigiKey Link; ComponentLink2URL: http://digikey.com/product-detail/en/panasonic-electronic-components/ERJ-6ENF2200V/P220CCT-ND/1746831; Composition: Thick Film; Device Package: 0805 (2012 Metric); Features: Automotive AEC-Q200; Height - Seated (Max): 0.028" (0.70mm); LastUpdated: 02/09/2020 01:15:19; Lifecycle Status: Active; Minimum Order: 1; Number of Terminations: 2; Operating Temperature: -55°C ~ 155°C; Package / Case: 0805 (2012 Metric); Packaging: TapeAndReel; PartId: 30101; Part Status: Active; Price: 0.01; Ratings: AEC-Q200; Resistance: 220 Ohms; Series: ERJ; Size / Dimension: 0.079" L x 0.049" W (2.00mm x 1.25mm); Supplier 1: DigiKey; Supplier Part Number 1: P220CCT-ND; Supplier Device Package: 0805; Tolerance: ±1%
R23 R25 R27 = CPF0805B10KE: RES SMD 10K OHM 0.1% 1/10W 0805; Manufacturer: TE Connectivity Passive Product; Power (Watts): 0.1W, 1/10W; Temperature Coefficient: ±25ppm/°C; Part Number: CPF0805B10KE; Value: 10 kOhms; ComponentLink1Description: Datasheet; ComponentLink1URL: https://www.te.com/commerce/DocumentDelivery/DDEController?Action=srchrtrv&DocNm=1773200&DocType=DS&DocLang=English; ComponentLink2Description: DigiKey Link; ComponentLink2URL: http://digikey.com/product-detail/en/te-connectivity-passive-product/CPF0805B10KE/A106043CT-ND/3477679; Composition: Thin Film; Device Package: 0805 (2012 Metric); Height - Seated (Max): 0.026" (0.65mm); LastUpdated: 02/09/2020 01:15:24; Lifecycle Status: Active; Minimum Order: 1; Number of Terminations: 2; Operating Temperature: -55°C ~ 155°C; Package / Case: 0805 (2012 Metric); Packaging: TapeAndReel; PartId: 27724; Part Status: Active; Price: 0.09; Resistance: 10 kOhms; Series: CPF, Neohm; Size / Dimension: 0.079" L x 0.049" W (2.00mm x 1.25mm); Supplier 1: DigiKey; Supplier Part Number 1: A106043CT-ND; Supplier Device Package: 0805; Tolerance: ±0.1%

## Sheet [05] - TK2560_OutputLEDs.SchDoc: 2560_TrainingKit
size A4; SheetNumber: 6; SheetTotal: 15
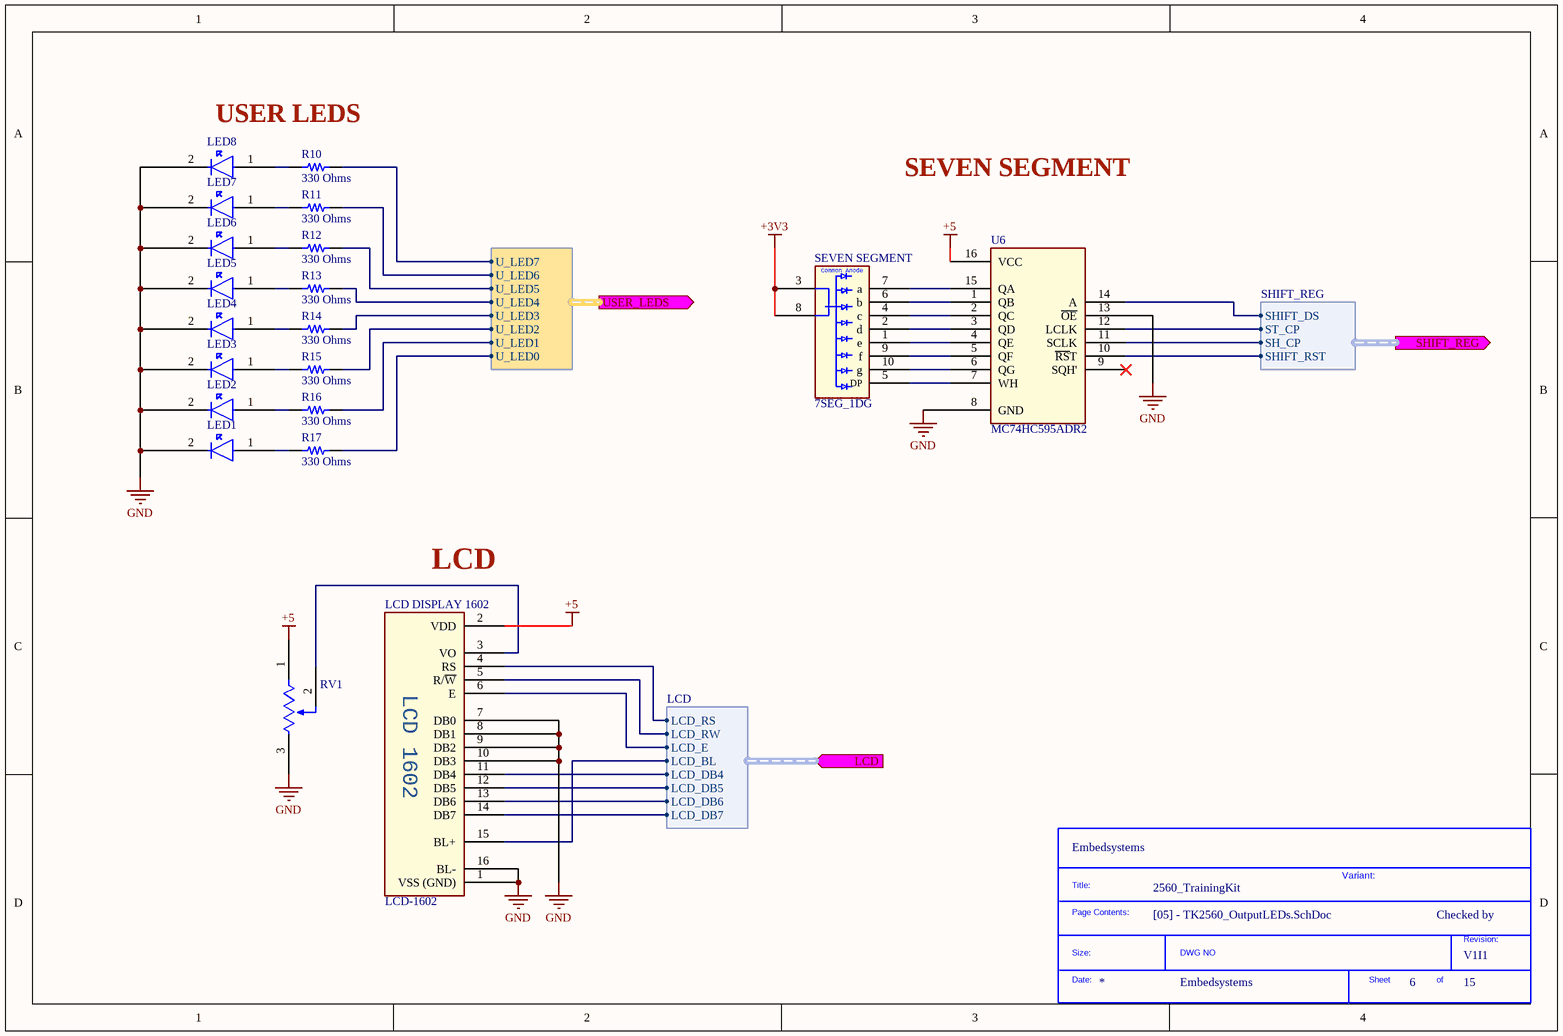
[diagram p5: [05] - TK2560_OutputLEDs.SchDoc]

### Parts
(Parts that share a designator on the sheet are numbered #1, #2 ... from top to bottom, then left to right.)
*?#5  SDTitleBlock  (value not drawn)  (graphical)
LCD_DISPLAY_1602  LCD-1602  [LCD1602]
LED1  LED_5mm  [LED_5mm]  (value not drawn)
LED2  LED_5mm  [LED_5mm]  (value not drawn)
LED3  LED_5mm  [LED_5mm]  (value not drawn)
LED4  LED_5mm  [LED_5mm]  (value not drawn)
LED5  LED_5mm  [LED_5mm]  (value not drawn)
LED6  LED_5mm  [LED_5mm]  (value not drawn)
LED7  LED_5mm  [LED_5mm]  (value not drawn)
LED8  LED_5mm  [LED_5mm]  (value not drawn)
R10  330 Ohms  [RES 0805_2012]
R11  330 Ohms  [RES 0805_2012]
R12  330 Ohms  [RES 0805_2012]
R13  330 Ohms  [RES 0805_2012]
R14  330 Ohms  [RES 0805_2012]
R15  330 Ohms  [RES 0805_2012]
R16  330 Ohms  [RES 0805_2012]
R17  330 Ohms  [RES 0805_2012]
RV1  3296W-10K_Trim_Pot  [3296W_TrimPot]  (value not drawn)
SEVEN_SEGMENT  7SEG_1DG  [7SEG_1DG]
U6  MC74HC595ADR2  [SOIC-16]

### Ports
LCD (in, harness LCD), SHIFT_REG (out, harness SHIFT_REG), USER_LEDS (out, harness USER_LEDS)

### Harnesses
LCD: LCD_RS, LCD_RW, LCD_E, LCD_BL, LCD_DB4, LCD_DB5, LCD_DB6, LCD_DB7
SHIFT_REG: SHIFT_RST, SH_CP, ST_CP, SHIFT_DS
USER_LEDS: U_LED0, U_LED1, U_LED2, U_LED3, U_LED4, U_LED5, U_LED6, U_LED7

### Nets
+3V3: SEVEN_SEGMENT.3 SEVEN_SEGMENT.8
+5: LCD_DISPLAY_1602.2(VDD) RV1.1 U6.16(VCC)
GND: LCD_DISPLAY_1602.1(VSS_(GND)) LCD_DISPLAY_1602.7(DB0) LCD_DISPLAY_1602.8(DB1) LCD_DISPLAY_1602.9(DB2) LCD_DISPLAY_1602.10(DB3) LCD_DISPLAY_1602.16(BL-) LED1.2 LED2.2 LED3.2 LED4.2 LED5.2 LED6.2 LED7.2 LED8.2 RV1.3 U6.8(GND) U6.13(~{OE})
NetLCD_DISPLAY_1602_3: LCD_DISPLAY_1602.3(VO) RV1.2
NetLCD_DISPLAY_1602_4: LCD_DISPLAY_1602.4(RS) ; port LCD.LCD_RS
NetLCD_DISPLAY_1602_5: LCD_DISPLAY_1602.5(R/~{W}) ; port LCD.LCD_RW
NetLCD_DISPLAY_1602_6: LCD_DISPLAY_1602.6(E) ; port LCD.LCD_E
NetLCD_DISPLAY_1602_11: LCD_DISPLAY_1602.11(DB4) ; port LCD.LCD_DB4
NetLCD_DISPLAY_1602_12: LCD_DISPLAY_1602.12(DB5) ; port LCD.LCD_DB5
NetLCD_DISPLAY_1602_13: LCD_DISPLAY_1602.13(DB6) ; port LCD.LCD_DB6
NetLCD_DISPLAY_1602_14: LCD_DISPLAY_1602.14(DB7) ; port LCD.LCD_DB7
NetLCD_DISPLAY_1602_15: LCD_DISPLAY_1602.15(BL+) ; port LCD.LCD_BL
NetLED1_1: LED1.1 R17.1
NetLED2_1: LED2.1 R16.1
NetLED3_1: LED3.1 R15.1
NetLED4_1: LED4.1 R14.1
NetLED5_1: LED5.1 R13.1
NetLED6_1: LED6.1 R12.1
NetLED7_1: LED7.1 R11.1
NetLED8_1: LED8.1 R10.1
NetR10_2: R10.2 ; port USER_LEDS.U_LED7
NetR11_2: R11.2 ; port USER_LEDS.U_LED6
NetR12_2: R12.2 ; port USER_LEDS.U_LED5
NetR13_2: R13.2 ; port USER_LEDS.U_LED4
NetR14_2: R14.2 ; port USER_LEDS.U_LED3
NetR15_2: R15.2 ; port USER_LEDS.U_LED2
NetR16_2: R16.2 ; port USER_LEDS.U_LED1
NetR17_2: R17.2 ; port USER_LEDS.U_LED0
NetSEVEN_SEGMENT_1: SEVEN_SEGMENT.1(e) U6.4(QE)
NetSEVEN_SEGMENT_2: SEVEN_SEGMENT.2(d) U6.3(QD)
NetSEVEN_SEGMENT_4: SEVEN_SEGMENT.4(c) U6.2(QC)
NetSEVEN_SEGMENT_5: SEVEN_SEGMENT.5(DP) U6.7(WH)
NetSEVEN_SEGMENT_6: SEVEN_SEGMENT.6(b) U6.1(QB)
NetSEVEN_SEGMENT_7: SEVEN_SEGMENT.7(a) U6.15(QA)
NetSEVEN_SEGMENT_9: SEVEN_SEGMENT.9(f) U6.5(QF)
NetSEVEN_SEGMENT_10: SEVEN_SEGMENT.10(g) U6.6(QG)
NetU1_47: U6.14(A) ; port SHIFT_REG.SHIFT_DS
NetU1_48: U6.12(LCLK) ; port SHIFT_REG.ST_CP
NetU1_49: U6.11(SCLK) ; port SHIFT_REG.SH_CP
NetU1_50: U6.10(~{RS}T) ; port SHIFT_REG.SHIFT_RST

Not connected (* = marked no-connect by the designer): U6 9(SQH')*

### Notes on the sheet
- USER LEDS
- SEVEN SEGMENT
- (near LCD_DISPLAY_1602) LCD
- Variant:
- Checked by
- (in symbol LCD-1602) LCD 1602
- (in symbol SDTitleBlock) Title:; Page Contents:; Revision:; Size:; DWG NO; Date:; Sheet; of

### Library data of the parts
LCD_DISPLAY_1602 = LCD-1602: LUMEX         LCM-S01602DTR/C             Alphanumeric LCD, 16 x 2, Black on Grey, 5V, Parallel, English, Japanese, Reflective; Number of Characters: 32; Character Height: 5.56mm; Character Width: 2.96mm; Background Color: Green; Number Of Characters Per Row: 16; Current Rating: 3mA; Viewing Area (width): 66mm; Viewing Area (height): 16mm; Supplier 1: Digi-Key; Manufacturer: Lumex; Manufacturer Part Number: LCM-S01602DTR/C; RoHS: Yes; Category: LCD, OLED, Graphic Displays; Stock 1: 70; Pricing 1: 1=11.49000, 10=8.33200, 100=6.88450, 500=6.02938, 1000=5.70050, 2000=5.56895, 5000=5.48125, 10000=5.37163 (USD); Case/Package: Module; Min Operating Temperature: 0°C; Max Operating Temperature: 50°C; Interface: Parallel; Operating Supply Voltage: 5V; Packaging: Bulk; Package Quantity: 45; Voltage Rating: 5V; Length: 85mm; Width: 85mm; Height: 30mm; REACH SVHC: No SVHC; Lead Free: Lead Free; ComponentLink1URL: https://datasheet.ciiva.com/1314/1701289-1314455.pdf?src-supplier=Newark; ComponentLink1Description: https://datasheet.ciiva.com/1314/1701289-1314455.pdf?src-supplier=Newark; ComponentLink2URL: https://datasheet.ciiva.com/1227/1701289-1227260.pdf?src-supplier=Element14; ComponentLink2Description: https://datasheet.ciiva.com/1227/1701289-1227260.pdf?src-supplier=Element14; Supplier Part Number 1: 67-1780-ND
LED1-LED8 = LED_5mm: 5MM LED; Manufacturer: Kingbright; Manufacturer Part Number: WP7113ND; Stock 1: 50; Pricing 1: 1=0.67000, 10=0.41100, 100=0.23650, 1000=0.18508, 2000=0.16966, 5000=0.15423, 10000=0.14395, 25000=0.13881 (USD); Supplier 1: Digi-Key; Supplier Part Number 1: 754-1896-ND; ComponentLink1Description: Datasheet; ComponentLink1URL: https://www.kingbrightusa.com/images/catalog/SPEC/WP7113ND.pdf
R10-R17 = RC0805FR-07330RL: RES SMD 330 OHM 1% 1/8W 0805; Manufacturer: Yageo; Power (Watts): 0.125W, 1/8W; Temperature Coefficient: ±100ppm/°C; Part Number: RC0805FR-07330RL; Value: 330 Ohms; ComponentLink1Description: Datasheet; ComponentLink1URL: https://www.yageo.com/upload/media/product/productsearch/datasheet/rchip/PYu-RC_Group_51_RoHS_L_10.pdf; ComponentLink2Description: DigiKey Link; ComponentLink2URL: http://digikey.com/product-detail/en/yageo/RC0805FR-07330RL/311-330CRCT-ND/730813; Composition: Thick Film; Device Package: 0805 (2012 Metric); Features: Moisture Resistant; Height - Seated (Max): 0.024" (0.60mm); LastUpdated: 02/09/2020 01:15:14; Lifecycle Status: Active; Minimum Order: 1; Number of Terminations: 2; Operating Temperature: -55°C ~ 155°C; Package / Case: 0805 (2012 Metric); Packaging: CutTape; PartId: 32600; Part Status: Active; Price: 0.10; Resistance: 330 Ohms; Series: RC; Size / Dimension: 0.079" L x 0.049" W (2.00mm x 1.25mm); Supplier 1: DigiKey; Supplier Part Number 1: 311-330CRCT-ND; Supplier Device Package: 0805; Tolerance: ±1%
RV1 = 3296W-10K_Trim_Pot: TRIMMER 10K OHM 0.5W PC PIN TOP; Manufacturer: Bourns; Manufacturer Part Number: 3296W-1-103; Tolerance: 10%; Power Rating: 500mW; Resistance: 10kR; Number of Turns: 25; Temperature Coefficient: 100ppm/°C; Voltage Rating (DC): 500V; RoHS: No; Category: Variable Resistors and Potentiometers; Stock 1: 58; Pricing 1: 1=4.38000, 10=3.83600, 25=3.42520, 50=3.21960, 100=3.15100, 250=3.01400, 500=2.46600, 1000=2.12350, 5000=1.91800 (USD); Mount: PCB,Through Hole; Weight: 0.03oz; Color: Blue; Contact Plating: Tin,Lead; Min Operating Temperature: -55°C; Max Operating Temperature: 125°C; Package Quantity: 50; Packaging: Rail/Tube; Termination: Pin; Resistor Type: Cermet; Max Power Dissipation: 500mW; Taper: Linear; Series: Trimpot® 3296 - Sealed; Technology: CERMET; Resistance Tolerance: 10%; Length: 9.53mm; Width: 9.53mm; Height: 0.395inch; Depth: 4.83mm; Thickness: 5.59mm; Radiation Hardening: No; REACH SVHC: No SVHC; Military Standard: Not; RoHS Compliant: No; ComponentLink1URL: https://datasheet.ciiva.com/3266/3296-3266186.pdf?src-supplier=Avnet; ComponentLink1Description: https://datasheet.ciiva.com/3266/3296-3266186.pdf?src-supplier=Avnet; ComponentLink2URL: https://datasheet.ciiva.com/2164/3296-2164077.pdf?src-supplier=Digi-Key; ComponentLink2Description: https://datasheet.ciiva.com/2164/3296-2164077.pdf?src-supplier=Digi-Key; ComponentLink3URL: https://datasheet.ciiva.com/1570/1815117-1570414.pdf?src-supplier=Newark; ComponentLink3Description: https://datasheet.ciiva.com/1570/1815117-1570414.pdf?src-supplier=Newark; Supplier Part Number 1: 3296W-103-ND
SEVEN_SEGMENT = 7SEG_1DG: LED Displays & Accessories Single Red 640nm Common Anode; Manufacturer: Kingbright; Manufacturer Part Number: SA05-11SRWA; Character Height: 12.7mm; Character Width: 7.3mm; Max Power Dissipation: 75mW; Forward Current: 20mA; Forward Voltage: 1.85V; Number of Characters: 1; Luminous Intensity: 34mcd; Number of Segments: 7; Display Type: Segment; RoHS: Yes; Category: LED Displays; Stock 1: 1638; Pricing 1: 1=1.96000, 10=1.24000, 100=0.91770, 500=0.84334, 1000=0.69451, 2000=0.65979, 5000=0.64490, 10000=0.63180 (USD); Mount: Through Hole; Case/Package: DIP; Number of Pins: 10; Color: Red; Min Operating Temperature: -40°C; Max Operating Temperature: 85°C; Package Quantity: 40; Element Configuration: Common Anode; Illumination Color: Red; Operating Supply Voltage: 1.85V; Wavelength: 640nm; Packaging: Bulk; Power Consumption: 75mW; Test Current: 20mA; Length: 0.75inch; Width: 0.5inch; Height: 0.748inch; Lead Free: Lead Free; RoHS Compliant: Yes; ComponentLink1URL: https://datasheet.ciiva.com/16484/sa05-11srwa-16484660.pdf?src-supplier=Future+Electronics; ComponentLink1Description: https://datasheet.ciiva.com/16484/sa05-11srwa-16484660.pdf?src-supplier=Future+Electronics; ComponentLink2URL: https://datasheet.ciiva.com/11771/0900766b802001c1-11771105.pdf?src-supplier=RSComponents; ComponentLink2Description: https://datasheet.ciiva.com/11771/0900766b802001c1-11771105.pdf?src-supplier=RSComponents; ComponentLink3URL: https://datasheet.ciiva.com/2104/sa05-11srwa-2104885.pdf?src-supplier=Digi-Key; ComponentLink3Description: https://datasheet.ciiva.com/2104/sa05-11srwa-2104885.pdf?src-supplier=Digi-Key; ComponentLink4URL: https://datasheet.ciiva.com/4421/sa05-11srwa-42646-4421784.pdf?src-supplier=Mouser; ComponentLink4Description: https://datasheet.ciiva.com/4421/sa05-11srwa-42646-4421784.pdf?src-supplier=Mouser; ComponentLink5URL: https://datasheet.ciiva.com/26291/sa05-11srwa-26291690.pdf?src-supplier=Digi-Key; ComponentLink5Description: https://datasheet.ciiva.com/26291/sa05-11srwa-26291690.pdf?src-supplier=Digi-Key; Supplier 1: Digi-Key; Supplier Part Number 1: 754-1677-5-ND
U6 = MC74HC595ADR2: IC SHIFT REGISTR 8BIT 3ST 16SOIC; Manufacturer: ON Semiconductor; Propagation Delay: 24ns; Max Supply Voltage: 6V; Number of Elements: 1; Number of Circuits: 2; Number of Input Lines: 3; Logic Function: Shift Register; Number of Bits per Element: 8; Output Type: 3-STATE; Manufacturer Part Number: MC74HC595ADR2; RoHS: No; Category: Shift Registers; Mount: Surface Mount; Case/Package: SOIC; Number of Pins: 16; Min Operating Temperature: -55°C; Max Operating Temperature: 125°C; Packaging: Tape and Reel; Package Quantity: 1; Number of Output Lines: 3; Number of Bits: 8; Voltage: 6V; Series: 74HC; Lead Free: Contains Lead; RoHS Compliant: No; ComponentLink1URL: https://datasheet.ciiva.com/1887/mc74hc595a-d-1887894.pdf?src-supplier=Digi-Key; ComponentLink1Description: https://datasheet.ciiva.com/1887/mc74hc595a-d-1887894.pdf?src-supplier=Digi-Key; ComponentLink2URL: https://datasheet.ciiva.com/1887/mc74hc595a-d-1887895.pdf?src-supplier=Digi-Key; ComponentLink2Description: https://datasheet.ciiva.com/1887/mc74hc595a-d-1887895.pdf?src-supplier=Digi-Key; Supplier 1: Digi-Key; Supplier Part Number 1: MC74HC595ADR2OSCT-ND

## Sheet [01] - TK2560_CoverPage.SchDoc: 2560_TrainingKit
size A3; DocumentNumber: 1; SheetNumber: 1; SheetTotal: 15
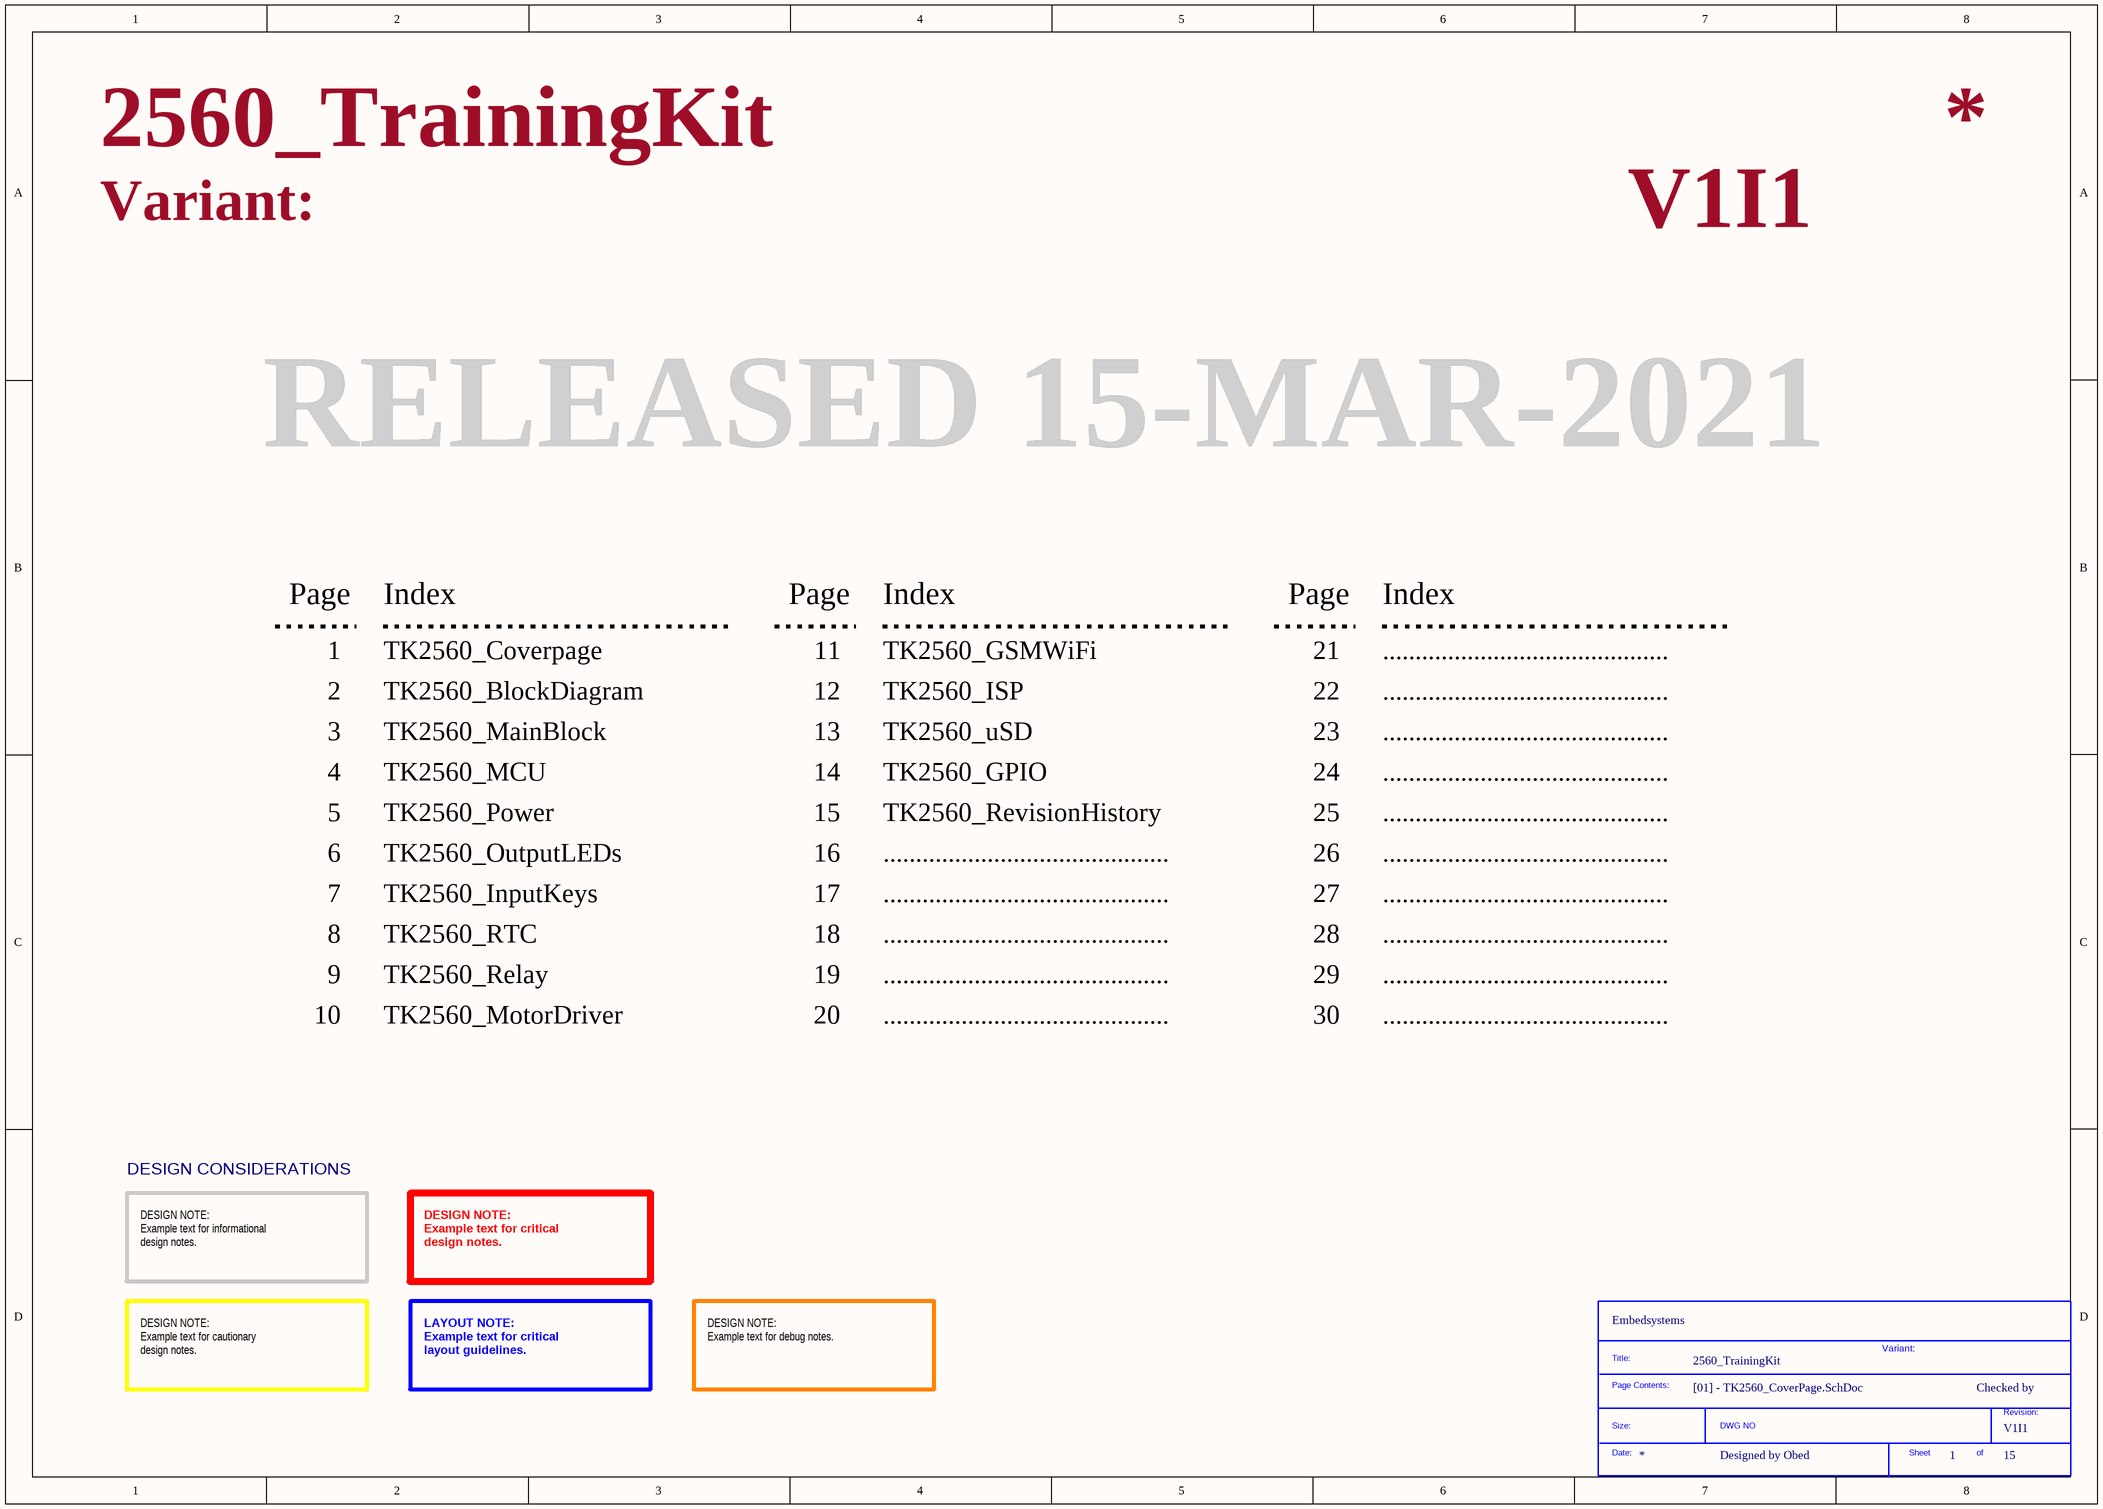
[diagram p6: [01] - TK2560_CoverPage.SchDoc]

### Parts
(Parts that share a designator on the sheet are numbered #1, #2 ... from top to bottom, then left to right.)
*#1  SDTitleBlock  (value not drawn)  (graphical)

### Notes on the sheet
- Variant:
- RELEASED 15-MAR-2021
- Page
- Index
- 1
- 2
- TK2560_Coverpage
- TK2560_BlockDiagram
- 11
- 12
- TK2560_GSMWiFi
- TK2560_ISP
- 21
- 22
- ............................................
- 3
- 4
- TK2560_MainBlock
- TK2560_MCU
- 13
- 14
- TK2560_uSD
- TK2560_GPIO
- 23
- 24
- 5
- TK2560_Power
- 15
- TK2560_RevisionHistory
- 25
- 6
- 7
- TK2560_OutputLEDs
- TK2560_InputKeys
- 16
- 17
- 26
- 27
- 8
- 9
- TK2560_RTC
- TK2560_Relay
- 18
- 19
- 28
- 29
- 10
- TK2560_MotorDriver
- 20
- 30
- DESIGN CONSIDERATIONS
- DESIGN NOTE:
  Example text for informational
  design notes.
- DESIGN NOTE:
  Example text for critical
  design notes.
- DESIGN NOTE:
  Example text for cautionary
  design notes.
- LAYOUT NOTE:
  Example text for critical
  layout guidelines.
- DESIGN NOTE:
  Example text for debug notes.
- Checked by
- Designed by Obed
- (in symbol SDTitleBlock) Title:; Page Contents:; Revision:; Size:; DWG NO; Date:; Sheet; of

## Sheet [02] - TK2560_BlockDiagram.SchDoc: 2560_TrainingKit
size A3; DocumentNumber: 2; SheetNumber: 2; SheetTotal: 15; PageSetup: Record=PageOptions|CenterHorizontal=True|CenterVertical=True|PrintScale=0.52|XCorrection=1.00|YCorrection=1.00|PrintKind=1|BorderSize=5000000|LeftOffset=0|BottomOffset=0|Orientation=2|PaperLength=1000|PaperWidth=1000|Scale=100|PaperSource=4|PrintQuality=600|MediaType=1|DitherType=10|PrintScaleMode=1|PaperKind=A4|PaperIndex=9
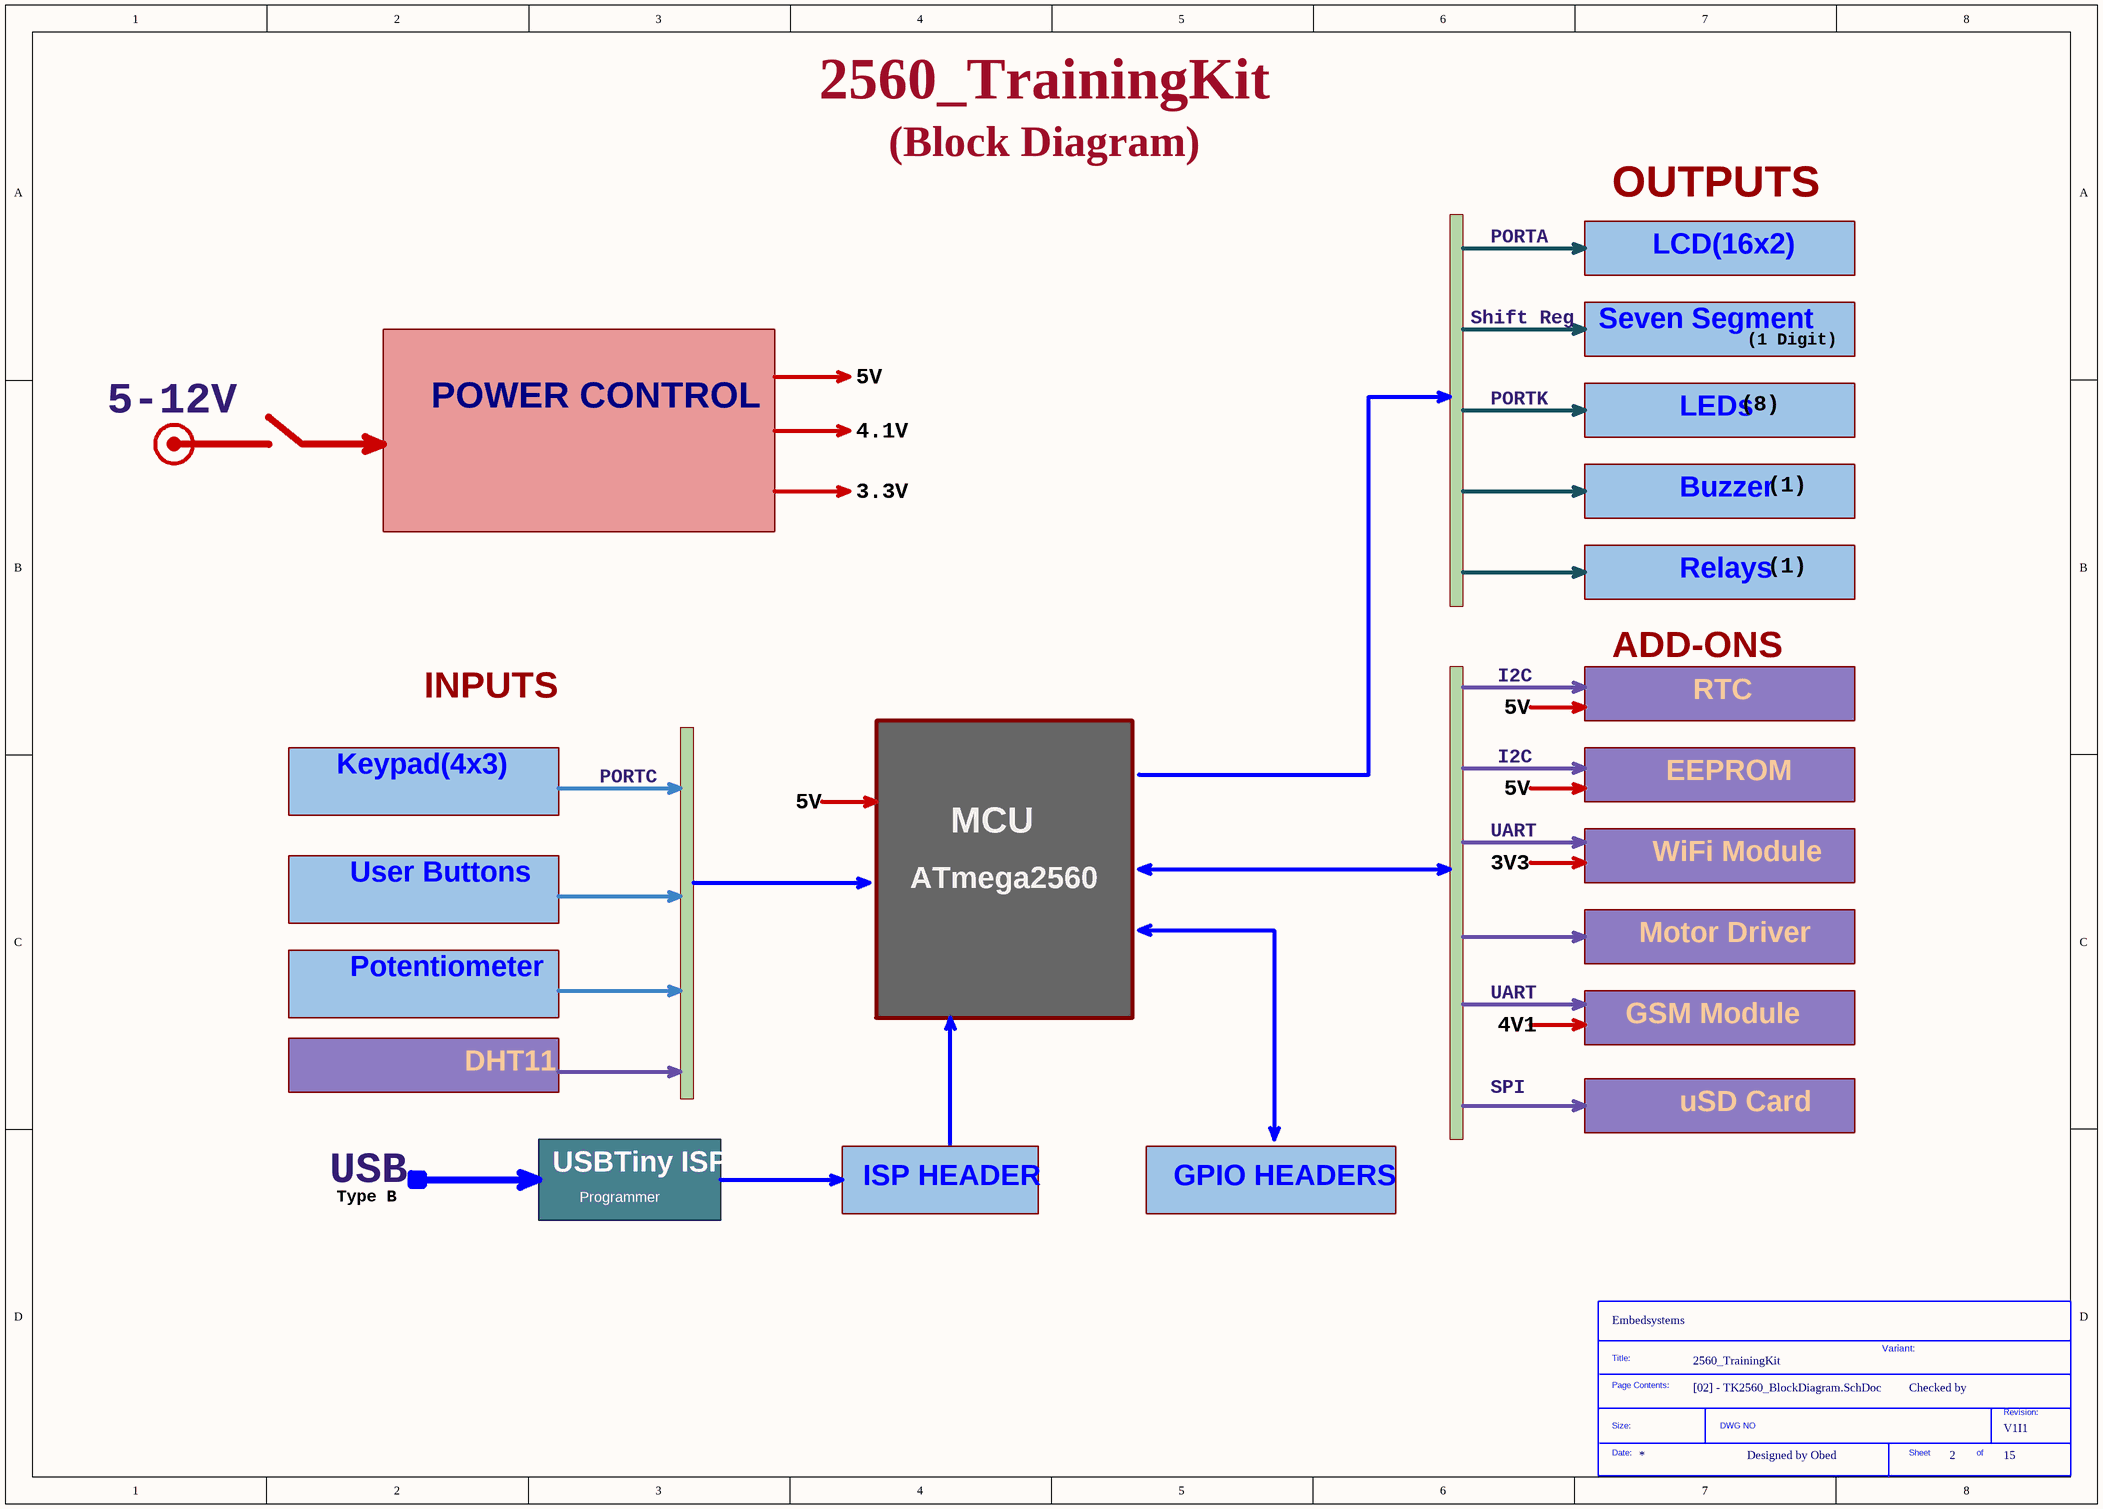
[diagram p7: [02] - TK2560_BlockDiagram.SchDoc]

### Parts
(Parts that share a designator on the sheet are numbered #1, #2 ... from top to bottom, then left to right.)
*#2  SDTitleBlock  (value not drawn)  (graphical)

### Notes on the sheet
- (Block Diagram)
- PORTA
- OUTPUTS
- LCD(16x2)
- Shift Reg
- Seven Segment
- (1 Digit)
- 5-12V
- POWER CONTROL
- 5V
- 4.1V
- PORTK
- LEDs
- (8)
- 3.3V
- Buzzer
- (1)
- Relays
- INPUTS
- I2C
- ADD-ONS
- RTC
- Keypad(4x3)
- PORTC
- EEPROM
- MCU
- UART
- User Buttons
- ATmega2560
- 3V3
- WiFi Module
- Potentiometer
- Motor Driver
- 4V1
- GSM Module
- DHT11
- SPI
- uSD Card
- USB
- USBTiny ISP
- ISP HEADER
- GPIO HEADERS
- Type B
- Programmer
- Variant:
- Checked by
- Designed by Obed
- (in symbol SDTitleBlock) Title:; Page Contents:; Revision:; Size:; DWG NO; Date:; Sheet; of